# Altium project KORUZA_RPi_shield.PrjPcb
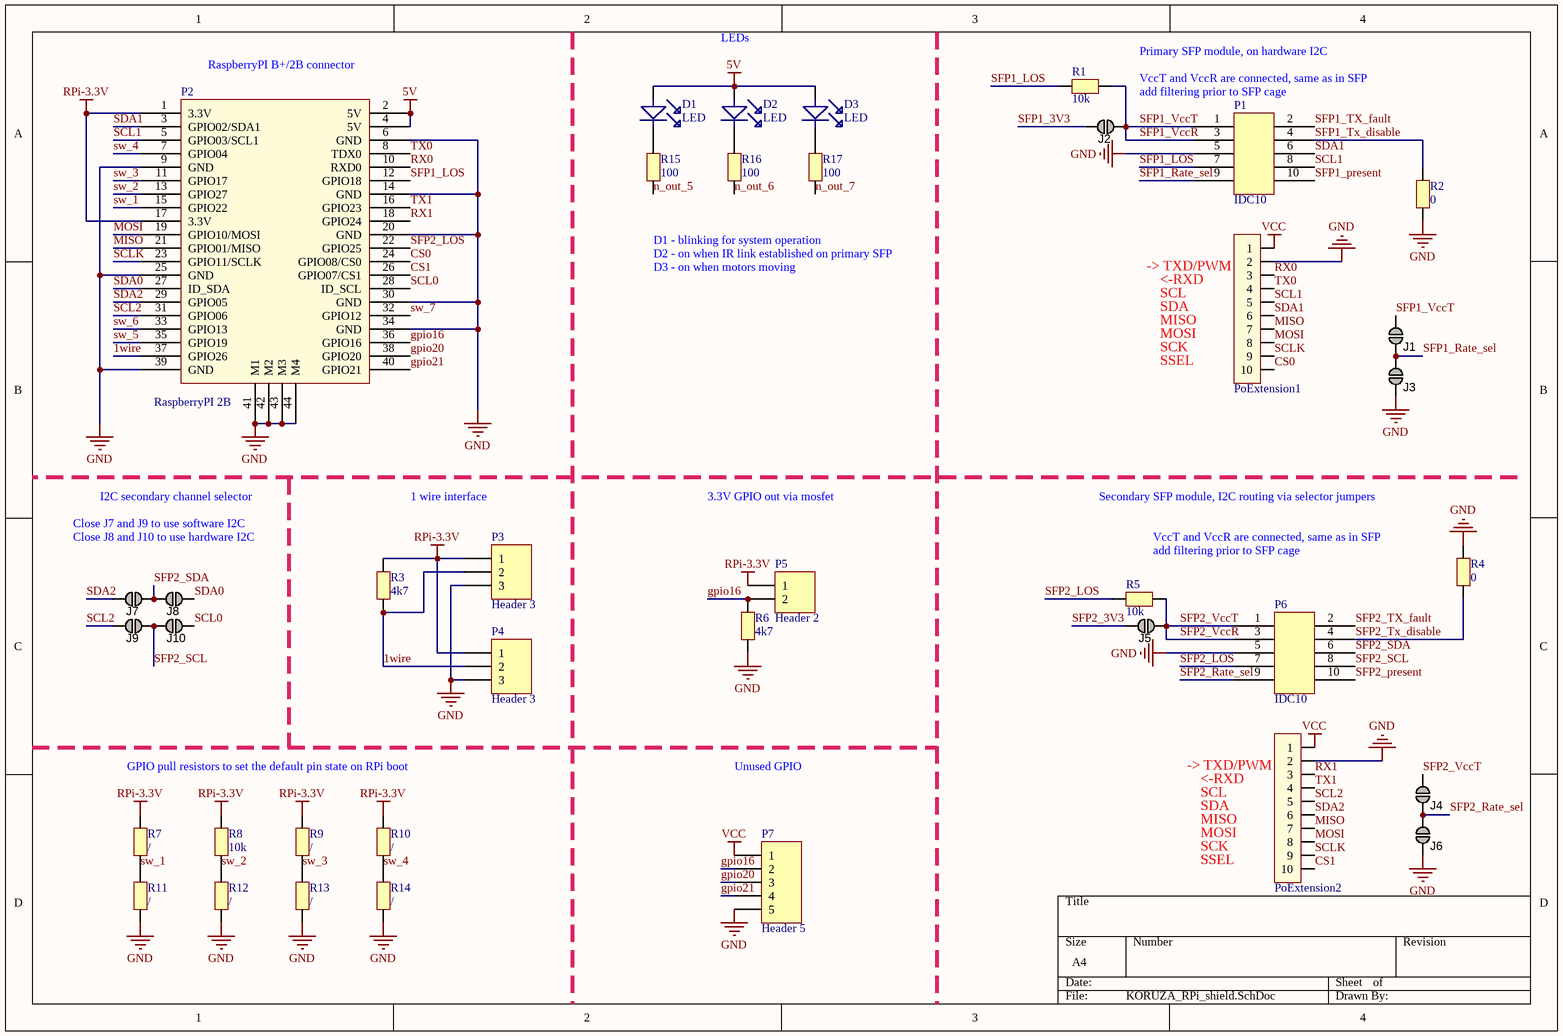
[diagram p0: KORUZA_RPi_shield.SchDoc]
2 sheets, 72 parts. Net scope: global (net labels, ports and power ports of the same name join across sheets).
Board file: KORUZA_RPi_shield.PcbDoc
Sheets:
  KORUZA_RPi_shield.SchDoc
  KORUZA_RPi_shield_power.SchDoc

## Sheet KORUZA_RPi_shield.SchDoc
size A4

### Parts
D1  LED  [1206/0805 diode]
D2  LED  [1206/0805 diode]
D3  LED  [1206/0805 diode]
J1  Jumper  [JUMP1]  (value not drawn)  (no BOM)
J2  Jumper  [JUMP1]  (value not drawn)  (no BOM)
J3  Jumper  [JUMP1]  (value not drawn)  (no BOM)
J4  Jumper  [JUMP1]  (value not drawn)  (no BOM)
J5  Jumper  [JUMP1]  (value not drawn)  (no BOM)
J6  Jumper  [JUMP1]  (value not drawn)  (no BOM)
J7  Jumper  [JUMP1]  (value not drawn)  (no BOM)
J8  Jumper  [JUMP1]  (value not drawn)  (no BOM)
J9  Jumper  [JUMP1]  (value not drawn)  (no BOM)
J10  Jumper  [JUMP1]  (value not drawn)  (no BOM)
P1  IDC10  [IDC10]
P2  RaspberryPI 2B  [RaspberryPI_B+]
P3  Header 3  [HDR1X3]
P4  Header 3  [HDR1X3]
P5  Header 2  [HDR1X2]
P6  IDC10  [IDC10]
P7  Header 5  [HDR1X5]
PoExtension1  (no value)  [8-188275-0]
PoExtension2  (no value)  [8-188275-0]
R1  10k  [RESC2012X06N]
R2  0  [RESC2012X06N]
R3  4k7  [RESC2012X06N]
R4  0  [RESC2012X06N]
R5  10k  [RESC2012X06N]
R6  4k7  [RESC2012X06N]
R7  /  [RESC2012X06N]
R8  10k  [RESC2012X06N]
R9  /  [RESC2012X06N]
R10  /  [RESC2012X06N]
R11  /  [RESC2012X06N]
R12  /  [RESC2012X06N]
R13  /  [RESC2012X06N]
R14  /  [RESC2012X06N]
R15  100  [RESC2012X06N]
R16  100  [RESC2012X06N]
R17  100  [RESC2012X06N]

### Nets
5V: D1.1 D2.1 D3.1 P2.2(5V) P2.4(5V)
GND: J3.1 J6.1 P1.5 P2.6(GND) P2.9(GND) P2.14(GND) P2.20(GND) P2.25(GND) P2.30(GND) P2.34(GND) P2.39(GND) P2.41(M1) P2.42(M2) P2.43(M3) P2.44(M4) P3.3 P4.3 P6.5 P7.5 PoExtension1.2 PoExtension2.2 R2.1 R4.2 R6.1 R11.1 R12.1 R13.1 R14.1
RPi-3.3V: P2.1(3.3V) P2.17(3.3V) P3.1 P4.1 P5.1 R3.2 R7.2 R8.2 R9.2 R10.2
VCC: P7.1 PoExtension1.1 PoExtension2.1
1wire: P2.37(GPIO26) P3.2 P4.2 R3.1
CS0: P2.24(GPIO08/CS0) PoExtension1.10
CS1: P2.26(GPIO07/CS1) PoExtension2.10
gpio16: P2.36(GPIO16) P5.2 P7.2 R6.2
gpio20: P2.38(GPIO20) P7.3
gpio21: P2.40(GPIO21) P7.4
MISO: P2.21(GPIO01/MISO) PoExtension1.7 PoExtension2.7
MOSI: P2.19(GPIO10/MOSI) PoExtension1.8 PoExtension2.8
n_out_5: R15.1
n_out_6: R16.1
n_out_7: R17.1
RX0: P2.10(RXD0) PoExtension1.3
RX1: P2.18(GPIO24) PoExtension2.3
SCL0: J10.2 P2.28(ID_SCL)
SCL1: P1.8 P2.5(GPIO03/SCL1) PoExtension1.5
SCL2: J9.1 P2.31(GPIO06) PoExtension2.5
SCLK: P2.23(GPIO11/SCLK) PoExtension1.9 PoExtension2.9
SDA0: J8.2 P2.27(ID_SDA)
SDA1: P1.6 P2.3(GPIO02/SDA1) PoExtension1.6
SDA2: J7.1 P2.29(GPIO05) PoExtension2.6
SFP1_3V3: J2.1
SFP1_LOS: P1.7 P2.12(GPIO18) R1.2
SFP1_present: P1.10
SFP1_Rate_sel: J1.1 J3.2 P1.9
SFP1_Tx_disable: P1.4 R2.2
SFP1_TX_fault: P1.2
SFP1_VccR: J1.2 J2.2 P1.1(A) P1.3 R1.1  [also labelled SFP1_VccT]
SFP2_3V3: J5.1
SFP2_LOS: P2.22(GPIO25) P6.7 R5.2
SFP2_present: P6.10
SFP2_Rate_sel: J4.1 J6.2 P6.9
SFP2_SCL: J9.2 J10.1 P6.8
SFP2_SDA: J7.2 J8.1 P6.6
SFP2_Tx_disable: P6.4 R4.1
SFP2_TX_fault: P6.2
SFP2_VccR: J4.2 J5.2 P6.1(A) P6.3 R5.1  [also labelled SFP2_VccT]
sw_1: P2.15(GPIO22) R7.1 R11.2
sw_2: P2.13(GPIO27) R8.1 R12.2
sw_3: P2.11(GPIO17) R9.1 R13.2
sw_4: P2.7(GPIO04) R10.1 R14.2
sw_5: P2.35(GPIO19)
sw_6: P2.33(GPIO13)
sw_7: P2.32(GPIO12)
TX0: P2.8(TDX0) PoExtension1.4
TX1: P2.16(GPIO23) PoExtension2.4
NetD1_2: D1.2 R15.2
NetD2_2: D2.2 R16.2
NetD3_2: D3.2 R17.2

### Notes on the sheet
- LEDs
- (near P2) RaspberryPI B+/2B connector
- VccT and VccR are connected, same as in SFP
- add filtering prior to SFP cage
- Primary SFP module, on hardware I2C
- D1 - blinking for system operation
- D2 - on when IR link established on primary SFP
- D3 - on when motors moving
- (near PoExtension1) -> TXD/PWM
- <-RXD
- SCL
- SDA
- MISO
- MOSI
- SCK
- SSEL
- I2C secondary channel selector
- 1 wire interface
- 3.3V GPIO out via mosfet
- Secondary SFP module, I2C routing via selector jumpers
- Close J7 and J9 to use software I2C
- Close J8 and J10 to use hardware I2C
- (near R5) add filtering prior to SFP cage
- GPIO pull resistors to set the default pin state on RPi boot
- Unused GPIO
- (near PoExtension2) -> TXD/PWM

### Library data of the parts
D1-D3 = LED: LED diode
J1-J10 = JUMP1: SMD jumper
P1 P6 = IDC10: IDC 10pin
P2 = RaspberryPI 2B: RPi2
P3 P4 = Header 3: Header, 3-Pin; LatestRevisionDate: 17-Jul-2002; LatestRevisionNote: Re-released for DXP Platform.; Publisher: Altium Limited
P5 = Header 2: Header, 2-Pin; LatestRevisionDate: 17-Jul-2002; LatestRevisionNote: Re-released for DXP Platform.; Publisher: Altium Limited
P7 = Header 5: Header, 5-Pin; LatestRevisionDate: 17-Jul-2002; LatestRevisionNote: Re-released for DXP Platform.; Publisher: Altium Limited
PoExtension1 PoExtension2 = 1-215079-0: Micro-Match female PCB connector 10 Positions THT
R1-R17 = Resistor: Resistor 0805 smd

## Sheet KORUZA_RPi_shield_power.SchDoc
size A4
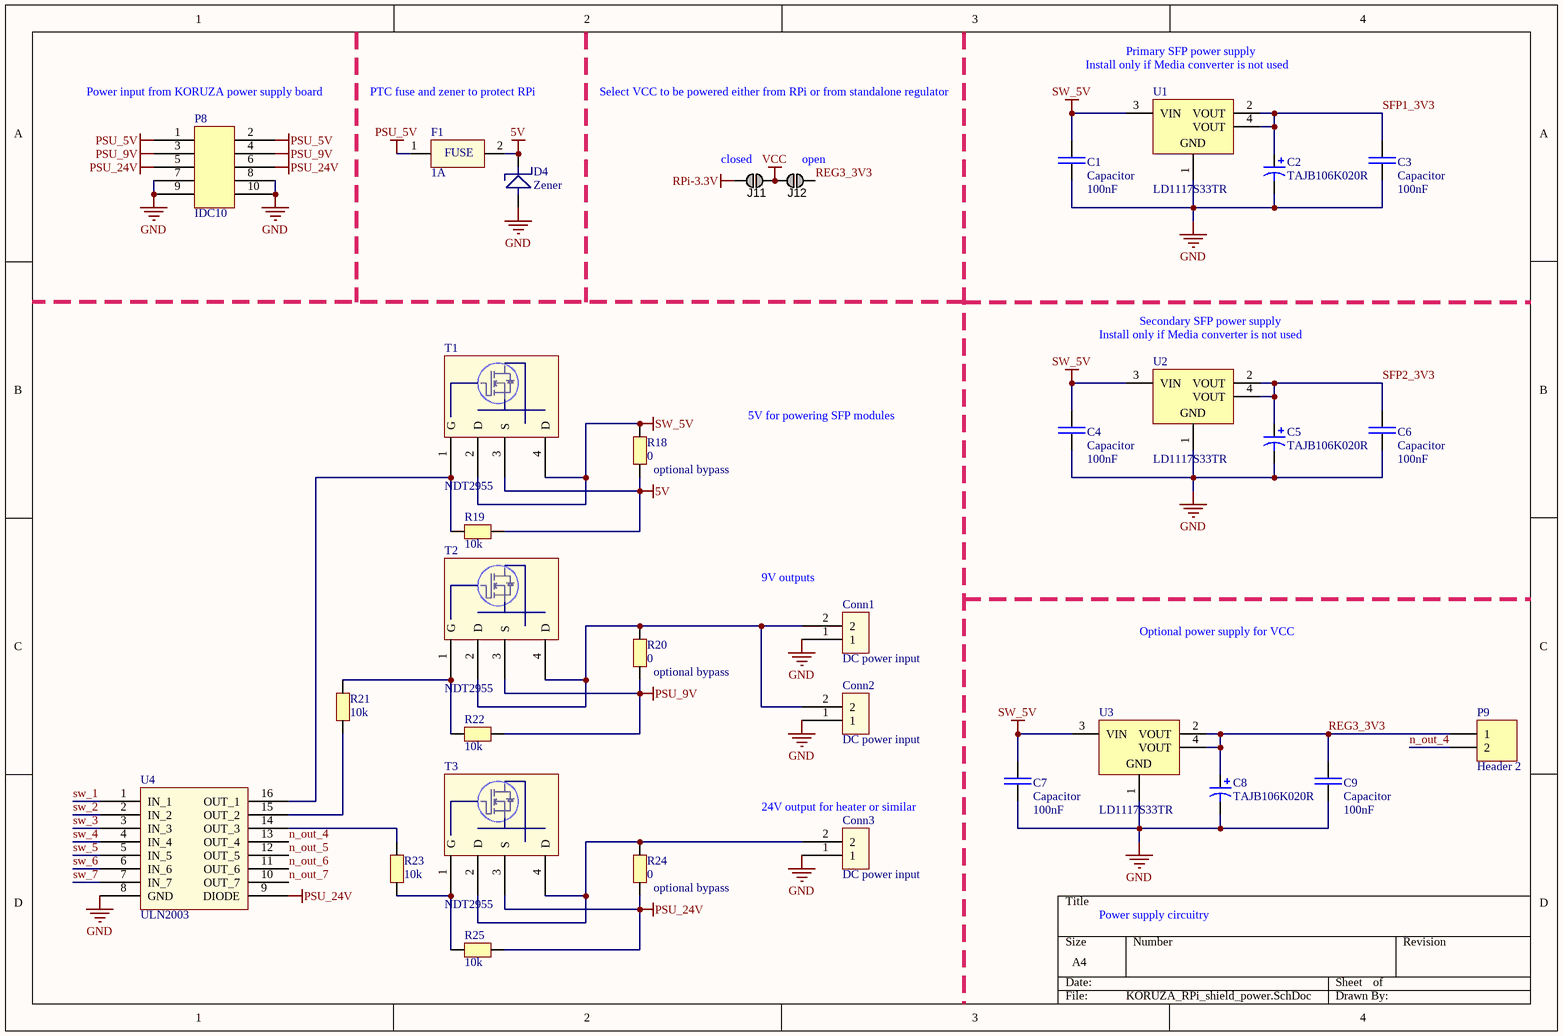
[diagram p1: KORUZA_RPi_shield_power.SchDoc]

### Parts
C1  Capacitor  value 100nF  [0603]
C2  TAJB106K020R  [AVX-CAPC3528_V]
C3  Capacitor  value 100nF  [0603]
C4  Capacitor  value 100nF  [0603]
C5  TAJB106K020R  [AVX-CAPC3528_V]
C6  Capacitor  value 100nF  [0603]
C7  Capacitor  value 100nF  [0603]
C8  TAJB106K020R  [AVX-CAPC3528_V]
C9  Capacitor  value 100nF  [0603]
Conn1  DC power input  [MKDSN 2,5/ 2-5,08 and powercon]
Conn2  DC power input  [MKDSN 2,5/ 2-5,08 and powercon]
Conn3  DC power input  [MKDSN 2,5/ 2-5,08 and powercon]
D4  Zener  [DIOMELF3517N]
F1  1A  [1210]
J11  Jumper  [JUMP1]  (value not drawn)  (no BOM)
J12  Jumper  [JUMP1]  (value not drawn)  (no BOM)
P8  IDC10  [IDC10]
P9  Header 2  [HDR1X2]
R18  0  [RESC2012X06N]
R19  10k  [RESC2012X06N]
R20  0  [RESC2012X06N]
R21  10k  [RESC2012X06N]
R22  10k  [RESC2012X06N]
R23  10k  [RESC2012X06N]
R24  0  [RESC2012X06N]
R25  10k  [RESC2012X06N]
T1  NDT2955  [SOT230P700X180-4N]
T2  NDT2955  [SOT230P700X180-4N]
T3  NDT2955  [SOT230P700X180-4N]
U1  LD1117S33TR  [SOT-223_L]
U2  LD1117S33TR  [SOT-223_L]
U3  LD1117S33TR  [SOT-223_L]
U4  ULN2003  [SO-16 narrow]

### Nets
5V: D4.1 F1.2 R18.2 R19.2 T1.3(S)
GND: C1.2 C2.2 C3.2 C4.2 C5.2 C6.2 C7.2 C8.2 C9.2 Conn1.1 Conn2.1 Conn3.1 D4.2 P8.7 P8.8 P8.9 P8.10 U1.1(GND) U2.1(GND) U3.1(GND) U4.8(GND)
PSU_5V: F1.1 P8.1(A) P8.2
PSU_9V: P8.3 P8.4 R20.2 R22.2 T2.3(S)
PSU_24V: P8.5 P8.6 R24.2 R25.2 T3.3(S) U4.9(DIODE)
RPi-3.3V: J11.1
SW_5V: C1.1 C4.1 C7.1 R18.1 T1.2(D) T1.4(D) U1.3(VIN) U2.3(VIN) U3.3(VIN)
VCC: J11.2 J12.1
n_out_4: P9.2 U4.13(OUT_4)
n_out_5: U4.12(OUT_5)
n_out_6: U4.11(OUT_6)
n_out_7: U4.10(OUT_7)
REG3_3V3: C8.1 C9.1 J12.2 P9.1 U3.2(VOUT) U3.4(VOUT)
SFP1_3V3: C2.1 C3.1 U1.2(VOUT) U1.4(VOUT)
SFP2_3V3: C5.1 C6.1 U2.2(VOUT) U2.4(VOUT)
sw_1: U4.1(IN_1)
sw_2: U4.2(IN_2)
sw_3: U4.3(IN_3)
sw_4: U4.4(IN_4)
sw_5: U4.5(IN_5)
sw_6: U4.6(IN_6)
sw_7: U4.7(IN_7)
NetConn1_2: Conn1.2 Conn2.2 R20.1 T2.2(D) T2.4(D)
NetConn3_2: Conn3.2 R24.1 T3.2(D) T3.4(D)
NetR19_1: R19.1 T1.1(G) U4.16(OUT_1)
NetR21_1: R21.1 U4.15(OUT_2)
NetR21_2: R21.2 R22.1 T2.1(G)
NetR23_1: R23.1 R25.1 T3.1(G)
NetR23_2: R23.2 U4.14(OUT_3)

### Notes on the sheet
- (near P8) Power input from KORUZA power supply board
- PTC fuse and zener to protect RPi
- Select VCC to be powered either from RPi or from standalone regulator
- (near U1) Install only if Media converter is not used
- Primary SFP power supply
- (near J11) closed
- (near J12) open
- (near U2) Install only if Media converter is not used
- Secondary SFP power supply
- 5V for powering SFP modules
- (near R18) optional bypass
- (near Conn1) 9V outputs
- Optional power supply for VCC
- (near R20) optional bypass
- (near Conn3) 24V output for heater or similar
- (near R24) optional bypass
- Power supply circuitry
- (in symbol Fuse) FUSE

### Library data of the parts
C1 C3 C4 C6 C7 C9 = Capacitor: General capacitor
C2 C5 C8 = CMP-0279-00001-1: Capacitor, Tantalum, 10uF 10% 20V MCCT-B (3528); Manufacturer: AVX; Polarity: Polarized; PartNumber: TAJB106K020R; PackageDescription: 2-Pin SMT Capacitor, 3.5 x 2.8 mm Body; ComponentLink1URL: http://www.avx.com/; PackageReference: CAPC3528; ComponentLink2Description: Datasheet; Capacitance: 10uF; Technology: Tantalum; ComponentLink2URL: http://www.avx.com/docs/Catalogs/taj.pdf; Tolerance: 10%; ComponentLink1Description: Manufacturer URL; Rated Voltage: 20V; DatasheetVersion: Jun-13; Mounting Technology: Surface Mount
Conn1-Conn3 = PowerScrewTerminal
F1 = Fuse: 1A fuse
J11 J12 = JUMP1: SMD jumper
P8 = IDC10: IDC 10pin
P9 = Header 2: Header, 2-Pin; LatestRevisionDate: 17-Jul-2002; LatestRevisionNote: Re-released for DXP Platform.; Publisher: Altium Limited
R18-R25 = Resistor: Resistor 0805 smd
T1-T3 = NDT2955: P MOSFET
U1-U3 = CMP-0244-00310-1: Fixed Low Drop Positive Voltage Regulator, 3.3V, 4-Pin SOT-223, Tape and Reel; ComponentLink2Description: Datasheet; PackageDescription: 4-Pin SOT-223 Package, 6.5 x 3.5 mm Body, 2.3 mm Pitch, 7 mm Lead Span; PackageVersion: 2010; ComponentLink2URL: http://www.st.com/internet/com/TECHNICAL_RESOURCES/TECHNICAL_LITERATURE/DATASHEET/CD00000544.pdf; PackageReference: SOT-223; DatasheetVersion: 1/11/2011; ComponentLink1Description: Manufacturer URL; ComponentLink1URL: http://www.st.com
U4 = ULN2003: Darlington array

## Nets that join several sheets
5V: KORUZA_RPi_shield (5 pins), KORUZA_RPi_shield_power (5 pins)
GND: KORUZA_RPi_shield (28 pins), KORUZA_RPi_shield_power (21 pins)
RPi-3.3V: KORUZA_RPi_shield (10 pins), KORUZA_RPi_shield_power (J11.1)
VCC: KORUZA_RPi_shield (P7.1 PoExtension1.1 PoExtension2.1), KORUZA_RPi_shield_power (J11.2 J12.1)
n_out_5: KORUZA_RPi_shield (R15.1), KORUZA_RPi_shield_power (U4.12)
n_out_6: KORUZA_RPi_shield (R16.1), KORUZA_RPi_shield_power (U4.11)
n_out_7: KORUZA_RPi_shield (R17.1), KORUZA_RPi_shield_power (U4.10)
SFP1_3V3: KORUZA_RPi_shield (J2.1), KORUZA_RPi_shield_power (C2.1 C3.1 U1.2 U1.4)
SFP2_3V3: KORUZA_RPi_shield (J5.1), KORUZA_RPi_shield_power (C5.1 C6.1 U2.2 U2.4)
sw_1: KORUZA_RPi_shield (P2.15 R7.1 R11.2), KORUZA_RPi_shield_power (U4.1)
sw_2: KORUZA_RPi_shield (P2.13 R8.1 R12.2), KORUZA_RPi_shield_power (U4.2)
sw_3: KORUZA_RPi_shield (P2.11 R9.1 R13.2), KORUZA_RPi_shield_power (U4.3)
sw_4: KORUZA_RPi_shield (P2.7 R10.1 R14.2), KORUZA_RPi_shield_power (U4.4)
sw_5: KORUZA_RPi_shield (P2.35), KORUZA_RPi_shield_power (U4.5)
sw_6: KORUZA_RPi_shield (P2.33), KORUZA_RPi_shield_power (U4.6)
sw_7: KORUZA_RPi_shield (P2.32), KORUZA_RPi_shield_power (U4.7)